# EAGLE design power-transistors (EAGLE 4.16)
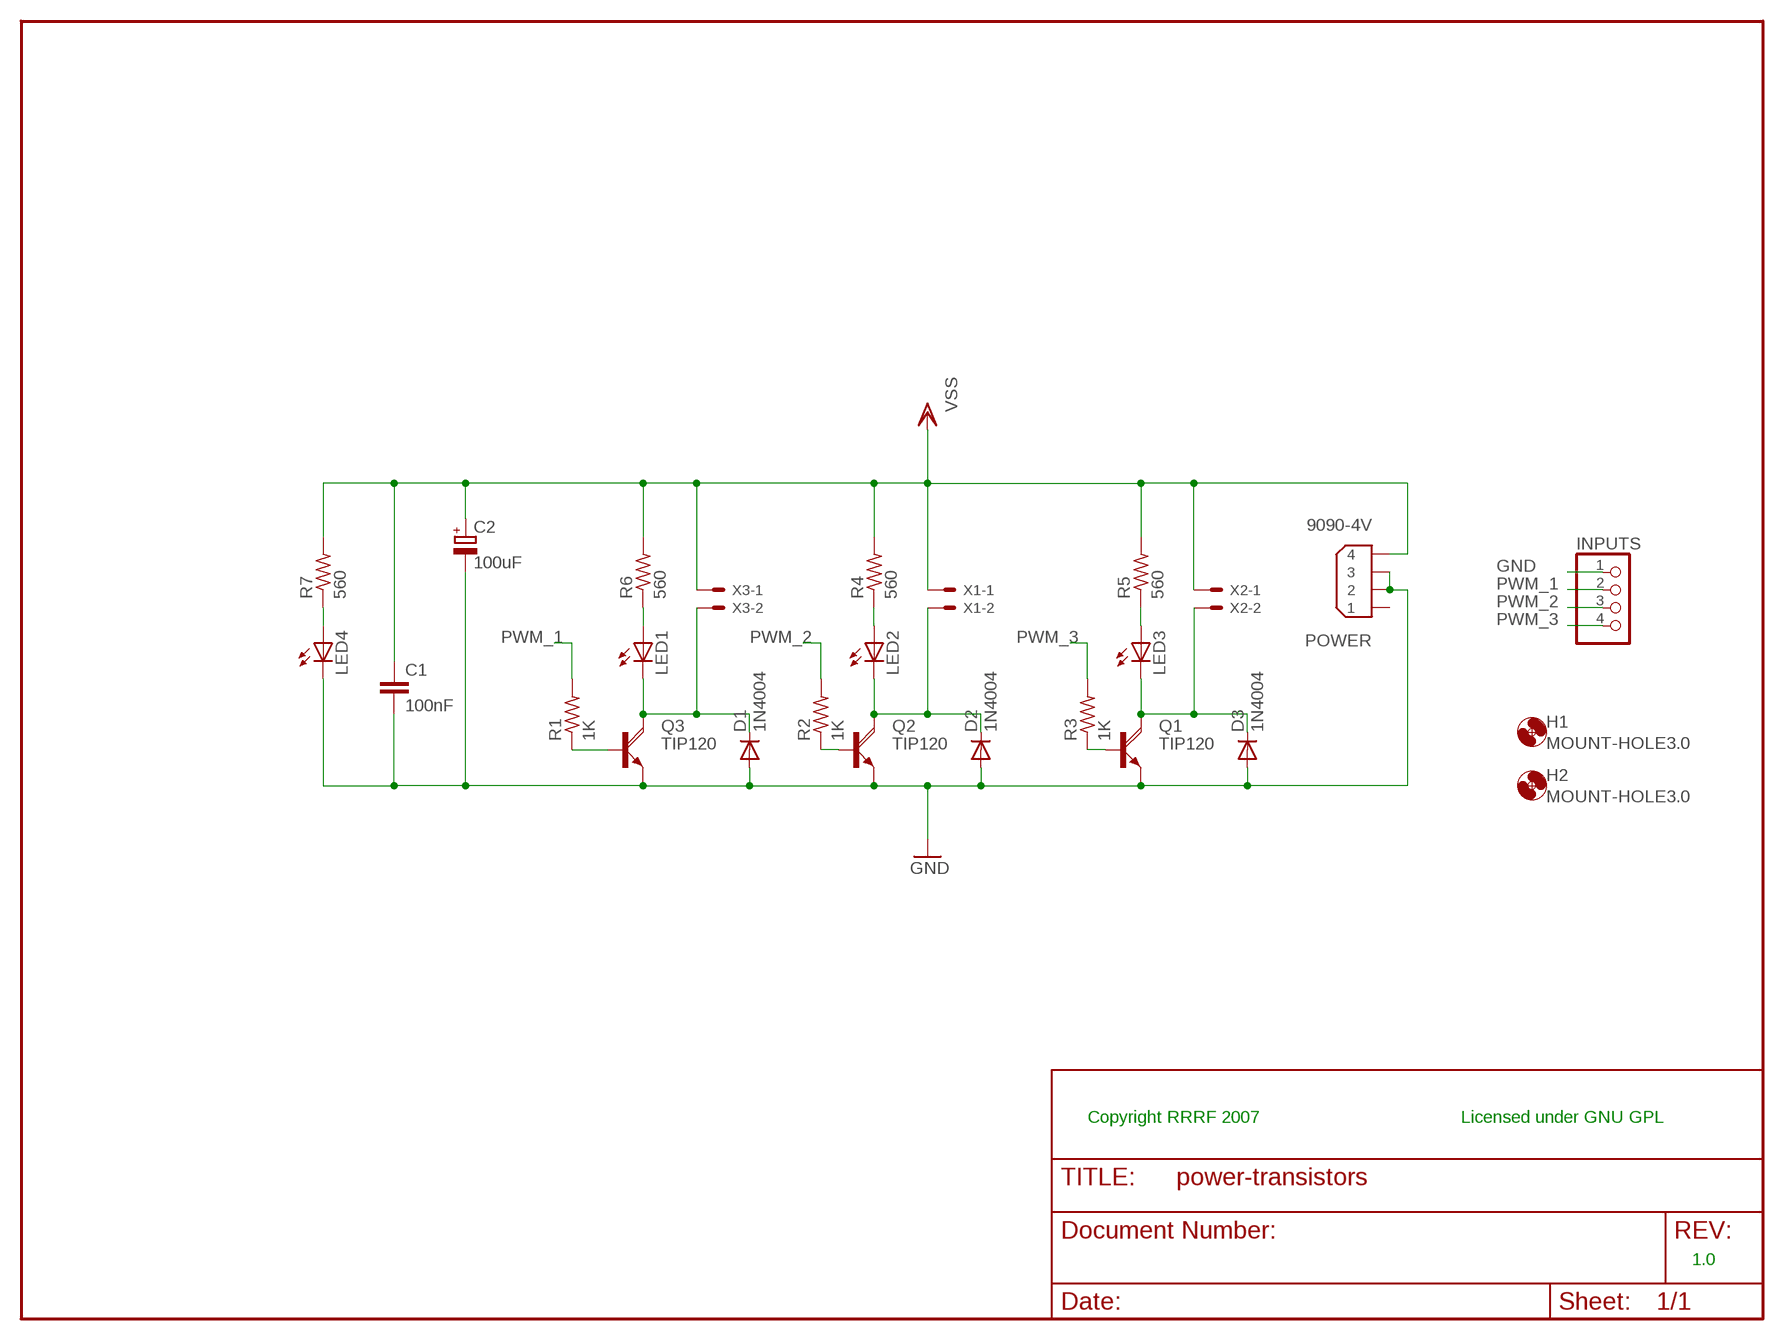
[diagram p0: schematic, sheet 1]

## Parts
C1  100nF  C-EU050-045X075  [C050-045X075]
C2  100uF  CPOL-EUE3.5-8  [E3,5-8]
D1  1N4004  [DO41-10]
D2  1N4004  [DO41-10]
D3  1N4004  [DO41-10]
H1  MOUNT-HOLE3.0  [3,0]
H2  MOUNT-HOLE3.0  [3,0]
INPUTS  PINHD-1X4  [1X04]
LED1  LED5MM  [LED5MM]
LED2  LED5MM  [LED5MM]
LED3  LED5MM  [LED5MM]
LED4  LED5MM  [LED5MM]
POWER  9090-4V  [9090-4V]
Q1  TIP120  [TO220AH]
Q2  TIP120  [TO220AH]
Q3  TIP120  [TO220AH]
R1  1K  R-US_0207/7  [0207/7]
R2  1K  R-US_0207/7  [0207/7]
R3  1K  R-US_0207/7  [0207/7]
R4  560  R-US_0207/7  [0207/7]
R5  560  R-US_0207/7  [0207/7]
R6  560  R-US_0207/7  [0207/7]
R7  560  R-US_0207/7  [0207/7]
X1  KK-156-2  [KK-156-2]
X2  KK-156-2  [KK-156-2]
X3  KK-156-2  [KK-156-2]

## Nets
GND: C1.2 C2.- D1.A D2.A D3.A INPUTS.1 LED4.K(C) POWER.2 POWER.3 Q1.E Q2.E Q3.E
N$1: D1.C LED1.K(C) Q3.C X3.2
N$2: D2.C LED2.K(C) Q2.C X1.2
N$3: D3.C LED3.K(C) Q1.C X2.2
N$4 [signal]: LED3.A R5.1
N$5 [signal]: LED2.A R4.1
N$6: Q2.B R2.1
N$7: Q1.B R3.1
N$8: Q3.B R1.1
N$9 [signal]: LED1.A R6.1
N$10 [signal]: LED4.A R7.1
PWM_1 [signal]: INPUTS.2 R1.2
PWM_2 [signal]: INPUTS.3 R2.2
PWM_3 [signal]: INPUTS.4 R3.2
VSS: C1.1 C2.+ POWER.4 R4.2 R5.2 R6.2 R7.2 X1.1 X2.1 X3.1
Unconnected: POWER.1

## Notes on the sheet
- Copyright RRRF 2007 | Licensed under GNU GPL
- 1.0

## Library data of the parts
C1 = rcl:C-EU: CAPACITOR, European symbol
C2 = rcl:CPOL-EU: POLARIZED CAPACITOR, European symbol
D1-D3 = diode:1N4004: DIODE general purpose rectifier, 1 A
H1 H2 = holes:MOUNT-HOLE: MOUNTING HOLE with drill center marker
INPUTS = pinhead:PINHD-1X4: PIN HEADER
LED1-LED4 = led:LED: LED OSRAM: - CHIPLED LG R971, LG N971, LY N971, LG Q971, LY Q971, LO R971, LY R971 LH N974, LH R974 LS Q976, LO Q976, LY Q976 LO Q996 - Hyper CHIPLED LW Q18S LB Q993, LB Q99A, LB R99A - SideLED LS A670, LO A670, LY A670, LG A670, LP A670 LB A673, LV A673, LT A673, LW A673 LH A674 LY A675 LS A676, LA A676, LO A676, LY A676, LW A676 LS A679, LY A679, LG A679 - Hyper Micro SIDELED® LS Y876, LA Y876, LO Y876, LY Y876 LT Y87S - SmartLED LW L88C, LW L88S LB L89C, LB L89S, LG L890 LS L89K, LO L89K, LY L89K LS L896, LA L896, LO L896, LY L896 - TOPLED LS T670, LO T670, LY T670, LG T670, LP T670 LSG T670, LSP T670, LSY T670, LOP T670, LYG T670 LG T671, LOG T671, LSG T671 LB T673, LV T673, LT T673, LW T673 LH T674 LS T676, LA T676, LO T676, LY T676, LB T676, LH T676, LSB T676, LW T676 LB T67C, LV T67C, LT T67C, LS T67K, LO T67K, LY T67K, LW E67C LS E67B, LA E67B, LO E67B, LY E67B, LB E67C, LV E67C, LT E67C LW T67C LS T679, LY T679, LG T679 LS T770, LO T770, LY T770, LG T770, LP T770 LB T773, LV T773, LT T773, LW T773 LH T774 LS E675, LA E675, LY E675, LS T675 LS T776, LA T776, LO T776, LY T776, LB T776 LHGB T686 LT T68C, LB T68C - Hyper Mini TOPLED® LB M676 - Mini TOPLED Santana® LG M470 LS M47K, LO M47K, LY M47K Source: http://www.osram.convergy.de - LUMILED® LXK2-PW12-R00, LXK2-PW12-S00, LXK2-PW14-U00, LXK2-PW14-V00 LXK2-PM12-R00, LXK2-PM12-S00, LXK2-PM14-U00 LXK2-PE12-Q00, LXK2-PE12-R00, LXK2-PE12-S00, LXK2-PE14-T00, LXK2-PE14-U00 LXK2-PB12-K00, LXK2-PB12-L00, LXK2-PB12-M00, LXK2-PB14-N00, LXK2-PB14-P00, LXK2-PB14-Q00 LXK2-PR12-L00, LXK2-PR12-M00, LXK2-PR14-Q00, LXK2-PR14-R00 LXK2-PD12-Q00, LXK2-PD12-R00, LXK2-PD12-S00 LXK2-PH12-R00, LXK2-PH12-S00 LXK2-PL12-P00, LXK2-PL12-Q00, LXK2-PL12-R00 Source: www.luxeon.com
POWER = con-thomas-betts:9090-4: Disk Drive Power four position Source: Thomas & Betts Electronic Interconnects Eiropean Edition 1998
Q1-Q3 = transistor-power:TIP120: NPN DARLINGTON TRANSISTOR
R1-R7 = rcl:R-US_: RESISTOR, American symbol
X1-X3 = con-molex:KK-156-2: KK 156 HEADER Source: http://www.molex.com/pdm_docs/sd/026604100_sd.pdf

## Net classes
0 default: width 1.676 mm, drill 0.508 mm
1 signal: width 0.635 mm, drill 0.381 mm

## Board
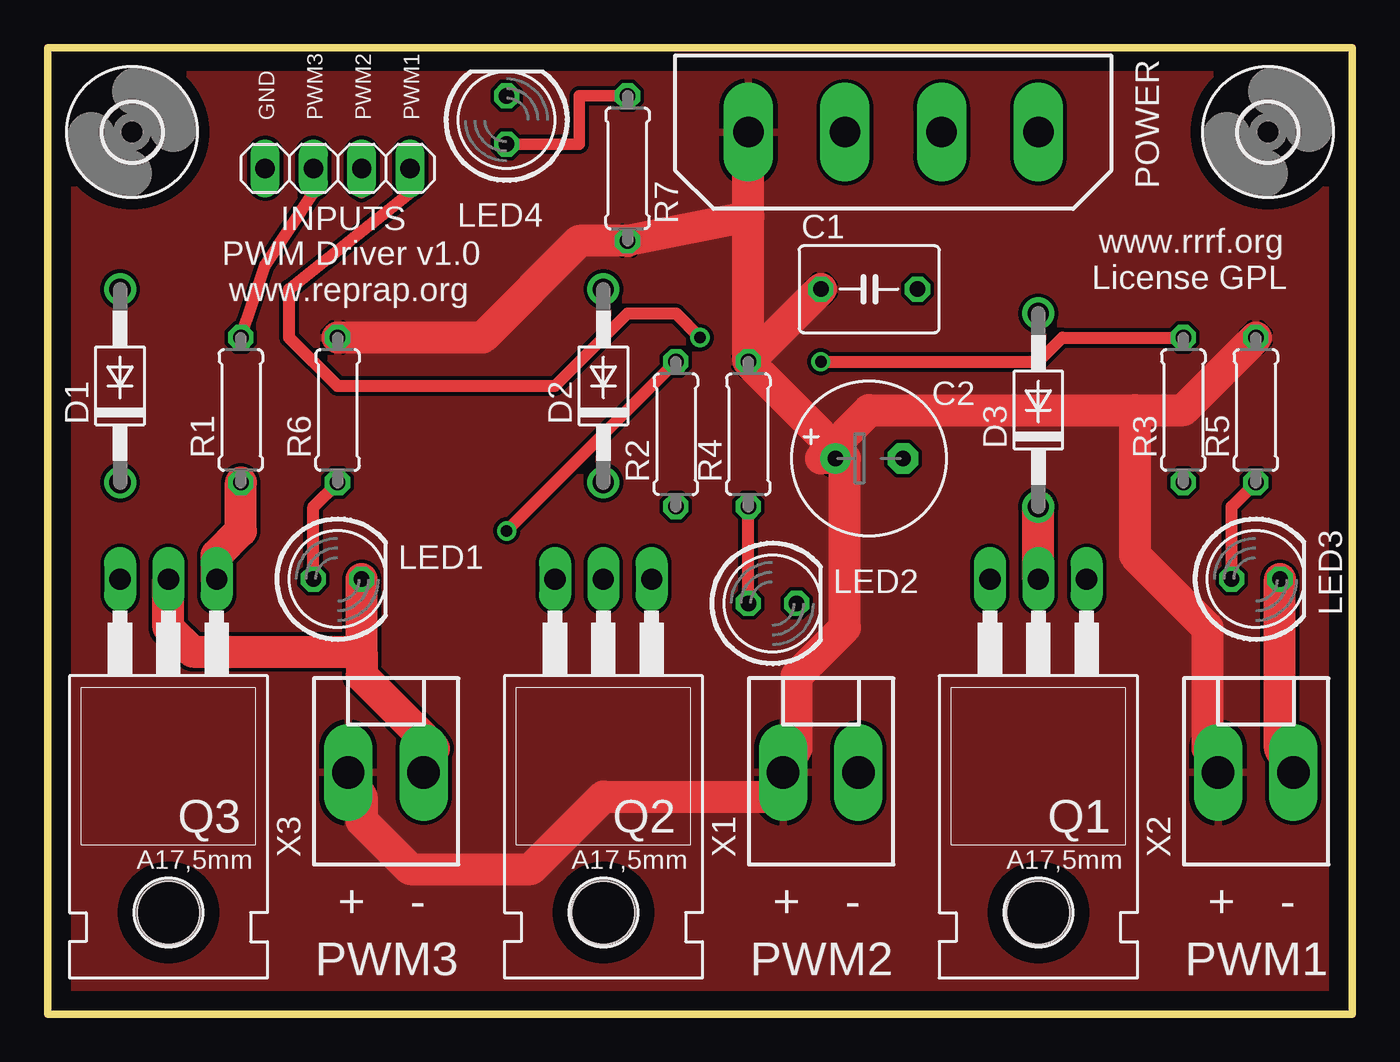
[diagram p1: board, top side]
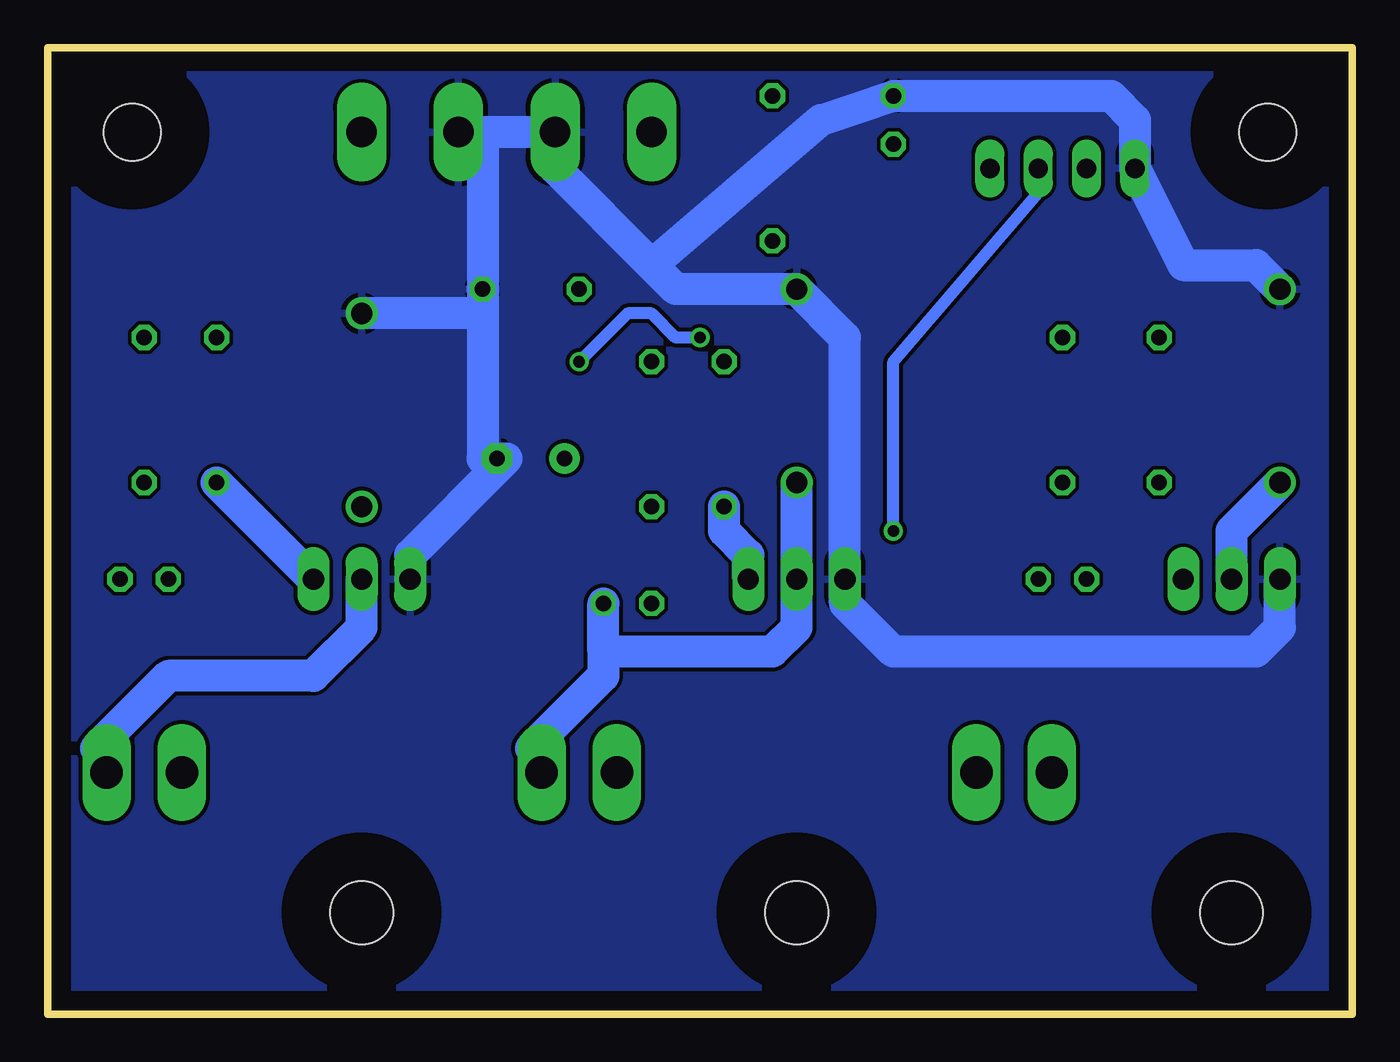
[diagram p2: board, bottom side, seen from below]

Size 68.58 x 50.8 mm. Coordinates in mm from the lower left corner, seen from the top.
Outline: 68.58,0 68.58,50.8 0,50.8 0,0 68.58,0
Copper layers (1*16): Top 0.035mm / dielectric 1.5mm / Bottom 0.035mm
Design rules "default": minimum track width 10mil, minimum drill 24mil, track to track 8mil, track to pad 8mil, pad to pad 8mil, via to via 8mil, smd to smd 8mil, copper to edge 40mil, drill to drill 8mil, minimum pad ring 10mil, minimum via ring 8mil, stop-mask expansion 4mil, vias tented up to drill 0mil, thermal gap 10mil

### Footprints (pad centres in the part's own frame; a part is rotated, then mirrored left to right if it is on the bottom)
C050-045X075 = drill 0.813 octagon: 1 -2.54,0; 2 2.54,0
E3,5-8 = drill 0.813 pad 1.6 round: + -1.778,0 | drill 0.813 pad 1.6 octagon: - 1.778,0
DO41-10 = drill 1.118 round: A 5.08,0; C -5.08,0
3,0 = hole 3: 0,0
1X04 = drill 1.016 long: 1 -3.81,0; 2 -1.27,0; 3 1.27,0; 4 3.81,0
LED5MM = drill 0.813 octagon: A -1.27,0; K 1.27,0
9090-4V = drill 1.6 pad 2.6 long: 1 -7.62,0; 2 -2.54,0; 3 2.54,0; 4 7.62,0
TO220AH = drill 1.118 long: B -2.54,-6.35; C 0,-6.35; E 2.54,-6.35 | hole 3.302: 0,11.176
0207/7 = drill 0.813 octagon: 1 -3.81,0; 2 3.81,0
KK-156-2 = drill 1.7 pad 2.184 long: 1 -1.98,0; 2 1.98,0

### Placement (x,y rotation side)
C1  43.18,38.1 0 top
C2  43.18,29.21 0 top
D1  3.81,33.02 90 top
D2  29.21,33.02 90 top
D3  52.07,31.75 90 top
H1  64.14,46.36 0 top
H2  4.44,46.36 0 top
INPUTS  15.24,44.45 0 top
LED1  15.24,22.86 0 top
LED2  38.1,21.59 0 top
LED3  63.5,22.86 0 top
LED4  24.13,46.99 90 top
POWER  44.45,46.36 180 top
Q1  52.07,16.51 180 top
Q2  29.21,16.51 180 top
Q3  6.35,16.51 180 top
R1  10.16,31.75 90 top
R2  33.02,30.48 90 top
R3  59.69,31.75 90 top
R4  36.83,30.48 90 top
R5  63.5,31.75 90 top
R6  15.24,31.75 90 top
R7  30.48,44.45 270 top
X1  40.64,12.7 0 top
X2  63.5,12.7 0 top
X3  17.78,12.7 0 top

### Tracks (layer width: path | path; a pad name or v marks a point on that pad's centre or on a via)
GND
  Bottom 1.676: D1.A 5.08,39.37 8.89,39.37 INPUTS.1 11.43,46.99 12.7,48.26 LED4.K 27.94,46.99 36.83,39.37 | Q3.E 3.81,20.32 5.08,19.05 24.13,19.05 26.67,21.59 Q2.E 26.67,35.56 D2.A 35.56,38.1 36.83,39.37 | 36.83,39.37 41.91,44.45 POWER.3 POWER.2 45.72,45.72 C1.2 45.72,36.83 | 45.72,36.83 45.72,29.21 C2.- 44.45,29.21 49.53,24.13 Q1.E | 45.72,36.83 D3.A
  pour Bottom: -1.27,52.07 69.22,52.07 69.22,-0.64 -0.63,-0.64 -1.27,-0.64
N$1
  Top 1.676: 16.51,19.05 16.51,17.78 20.32,13.97 X3.2 | 16.51,19.05 LED1.K | 16.51,19.05 7.62,19.05 6.35,20.32 Q3.C
  Bottom 1.676: D1.C 6.35,25.4 Q3.C
N$2
  Bottom 1.676: D2.C Q2.C 29.21,20.32 30.48,19.05 39.37,19.05 | 39.37,19.05 39.37,17.78 43.18,13.97 X1.2 | 39.37,19.05 LED2.K
N$3
  Top 1.676: Q1.C D3.C | LED3.K 64.77,13.97 X2.2
  Bottom 1.676: Q1.C 52.07,20.32 54.61,17.78 62.23,17.78 66.04,13.97 X2.2
N$4
  Top 0.635: LED3.A 62.23,26.67 R5.1
N$5
  Top 0.635: LED2.A R4.1
N$6
  Bottom 1.676: R2.1 33.02,25.4 31.75,24.13 Q2.B
N$7
  Bottom 1.676: Q1.B R3.1
N$8
  Top 1.676: R1.1 10.16,25.4 8.89,24.13 Q3.B
N$9
  Top 0.635: LED1.A 13.97,26.67 R6.1
N$10
  Top 0.61: LED4.A 27.94,45.72 27.94,48.26 R7.1
PWM_1
  Top 0.635: R1.2 11.43,39.37 13.97,43.18 INPUTS.2
PWM_2  (via drill 0.61)
  Top 0.635: INPUTS.3 16.51,43.18 | v24.13,25.4 R2.2
  Bottom 0.635: v24.13,25.4 24.13,34.29 16.51,43.18 INPUTS.3
PWM_3  (via drill 0.61)
  Top 0.635: v34.29,35.56 33.02,36.83 30.48,36.83 26.67,33.02 15.24,33.02 12.7,35.56 12.7,38.1 19.05,43.18 INPUTS.4 | R3.2 53.34,35.56 52.07,34.29 v40.64,34.29
  Bottom 0.635: v40.64,34.29 38.1,36.83 36.83,36.83 35.56,35.56 v34.29,35.56
VSS
  Top 1.676: X3.1 16.51,11.43 16.51,10.16 19.05,7.62 25.4,7.62 29.21,11.43 38.1,11.43 X1.1 39.37,13.97 39.37,17.78 41.91,20.32 41.91,29.21 | R6.2 22.86,35.56 27.94,40.64 R7.2 36.83,41.91 | R4.2 C1.1 | R5.2 59.69,31.75 57.15,31.75 | 57.15,31.75 43.18,31.75 40.64,29.21 C2.+ 41.91,29.21 | 57.15,31.75 57.15,24.13 60.96,20.32 60.96,13.97 X2.1 | 41.91,29.21 R4.2 | R4.2 36.83,41.91 | 36.83,41.91 POWER.4
  pour Top: -0.63,51.44 69.22,51.44 69.22,-0.64 -0.63,-0.64

### Text on the board
tPlace: GND | PWM3 | PWM2 | PWM1 | www.rrrf.org | PWM Driver v1.0 | License GPL | www.reprap.org | + | - | + | - | + | - | PWM3 | PWM2 | PWM1